# Altium schematic sheet ATMega328 Control Board.SchDoc
size 508 x 241 mm; SheetNumber: 1; SheetTotal: 1
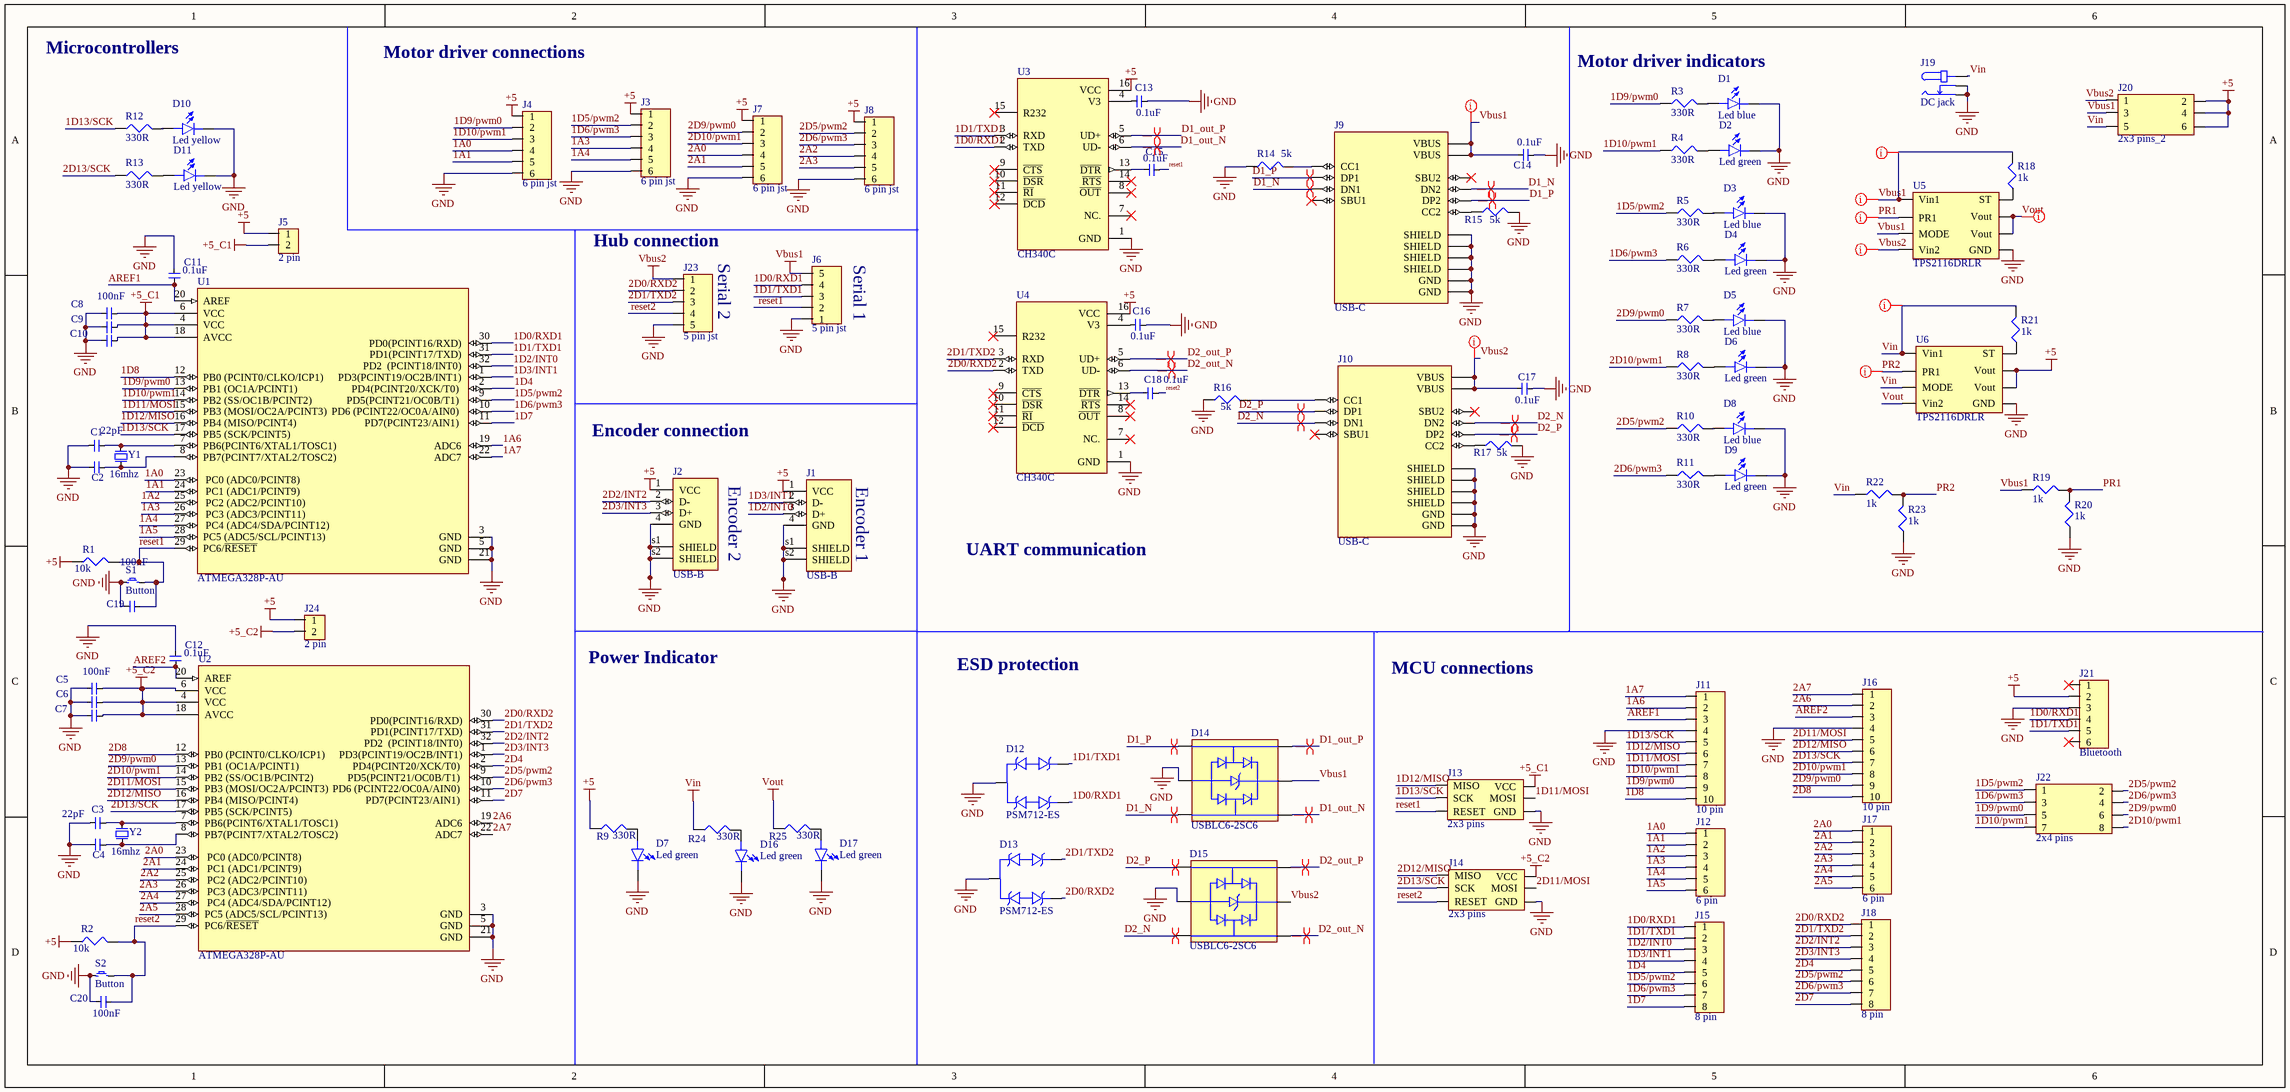
[diagram p0: ATMega328 Control Board.SchDoc]

## Parts
C1  22pF  [0603 cap]
C2  22pF  [0603 cap]  (value not drawn)
C3  22pF  [0603 cap]
C4  22pF  [0603 cap]  (value not drawn)
C5  100nF  [0603 cap]  (value not drawn)
C6  100nF  [0603 cap]  (value not drawn)
C7  100nF  [0603 cap]
C8  100nF  [0603 cap]  (value not drawn)
C9  100nF  [0603 cap]  (value not drawn)
C10  100nF  [0603 cap]
C11  0.1uF  [0603 cap]
C12  0.1uF  [0603 cap]
C13  0.1uF  [0603 cap]
C14  0.1uF  [0603 cap]
C15  0.1uF  [0603 cap]
C16  0.1uF  [0603 cap]
C17  0.1uF  [0603 cap]
C18  0.1uF  [0603 cap]
C19  100nF  [0603 cap]
C20  100nF  [0603 cap]
D1  Led blue  [0805led]
D2  Led green  [0805led]
D3  Led blue  [0805led]
D4  Led green  [0805led]
D5  Led blue  [0805led]
D6  Led green  [0805led]
D7  Led green  [0805led]
D8  Led blue  [0805led]
D9  Led green  [0805led]
D10  Led yellow  [0805led]
D11  Led yellow  [0805led]
D12  PSM712-ES  [sop23]
D13  PSM712-ES  [sop23]
D14  USBLC6-2SC6  [SOP23-6l]
D15  USBLC6-2SC6  [SOP23-6l]
D16  Led green  [0805led]
D17  Led green  [0805led]
J1  USB-B  [USB]
J2  USB-B  [USB]
J3  6 pin jst  [6 jst]
J4  6 pin jst  [6 jst]
J5  2 pin  [2 pin header]
J6  5 pin jst  [5 jst]
J7  6 pin jst  [6 jst]
J8  6 pin jst  [6 jst]
J9  USB-C  [USB-C]
J10  USB-C  [USB-C]
J11  10 pin  [10 pin header]
J12  6 pin  [6 pin header]
J13  2x3 pins  [2x3 pins]
J14  2x3 pins  [2x3 pins]
J15  8 pin  [8 pin heade]
J16  10 pin  [10 pin header]
J17  6 pin  [6 pin header]
J18  8 pin  [8 pin heade]
J19  DC jack  [DC jack]
J20  2x3 pins_2  [2x3 pins]
J21  Bluetooth  [6 pin header]
J22  2x4 pins  [2x4 pins]
J23  5 pin jst  [5 jst]
J24  2 pin  [2 pin header]
R1  10k  [0603 cap]
R2  10k  [0603 cap]
R3  330R  [0603 cap]
R4  330R  [0603 cap]
R5  330R  [0603 cap]
R6  330R  [0603 cap]
R7  330R  [0603 cap]
R8  330R  [0603 cap]
R9  330R  [0603 cap]
R10  330R  [0603 cap]
R11  330R  [0603 cap]
R12  330R  [0603 cap]
R13  330R  [0603 cap]
R14  5k  [0603 cap]
R15  5k  [0603 cap]
R16  5k  [0603 cap]
R17  5k  [0603 cap]
R18  1k  [0603 cap]
R19  1k  [0603 cap]
R20  1k  [0603 cap]
R21  1k  [0603 cap]
R22  1k  [0603 cap]
R23  1k  [0603 cap]
R24  330R  [0603 cap]
R25  330R  [0603 cap]
S1  Button  [button]
S2  Button  [button]
U1  ATMEGA328P-AU  [Quad32]
U2  ATMEGA328P-AU  [Quad32]
U3  CH340C  [sop 16]
U4  CH340C  [sop 16]
U5  TPS2116DRLR  [SOP8]
U6  TPS2116DRLR  [SOP8]
Y1  16mhz  [crystal]
Y2  16mhz  [crystal]

## Nets
+5: J1.1(VCC) J2.1(VCC) J3.1 J4.1 J5.1 J7.1 J8.1 J20.2 J20.4 J20.6 J21.2 J24.1 R1.1 R2.1 R9.1 U3.16(VCC) U4.16(VCC) U6.2(Vout) U6.7(Vout)
+5_C1: C8.2 C9.2 C10.2 J5.2 J13.2(VCC) U1.4(VCC) U1.6(VCC) U1.18(AVCC)
+5_C2: C5.2 C6.2 C7.2 J14.2(VCC) J24.2 U2.4(VCC) U2.6(VCC) U2.18(AVCC)
GND: C1.1 C2.1 C3.1 C4.1 C5.1 C6.1 C7.1 C8.1 C9.1 C10.1 C11.2 C12.2 C13.2 C14.2 C16.2 C17.2 C19.1 C20.1 D1.2 D2.2 D3.2 D4.2 D5.2 D6.2 D7.2 D8.2 D9.2 D10.2 D11.2 D12.3 D13.3 D14.2(GND) D15.2(GND) D16.2 D17.2 J1.4(GND) J1.s1(SHIELD) J1.s2(SHIELD) J2.4(GND) J2.s1(SHIELD) J2.s2(SHIELD) J3.6 J4.6 J6.1 J7.6 J8.6 J9.A1/B12(GND) J9.B1/A12(GND) J9.S1(SHIELD) J9.S2(SHIELD) J9.S3(SHIELD) J9.S4(SHIELD) J10.A1/B12(GND) J10.B1/A12(GND) J10.S1(SHIELD) J10.S2(SHIELD) J10.S3(SHIELD) J10.S4(SHIELD) J11.4 J13.6(GND) J14.6(GND) J16.4 J19.1 J19.3 J21.3 J23.5 R14.1 R15.2 R16.1 R17.2 R20.1 R23.1 S1.1 S2.1 U1.3(GND) U1.5(GND) U1.21(GND) U2.3(GND) U2.5(GND) U2.21(GND) U3.1(GND) U4.1(GND) U5.1(GND) U6.1(GND)
Vbus1: C14.1 D14.5(Vbus) J6.5 J9.A4/B9(VBUS) J9.B4/A9(VBUS) J20.3 R18.2 R19.1 U5.3(Vin1) U5.5(MODE)
Vbus2: C17.1 D15.5(Vbus) J10.A4/B9(VBUS) J10.B4/A9(VBUS) J20.1 J23.1 U5.6(Vin2)
Vin: J19.2 J20.5 R21.2 R22.1 R24.1 U6.3(Vin1) U6.5(MODE)
Vout: R25.1 U5.2(Vout) U5.7(Vout) U6.6(Vin2)
1A0: J4.4 J12.1 U1.23(PC0_(ADC0/PCINT8))
1A1: J4.5 J12.2 U1.24(PC1_(ADC1/PCINT9))
1A2: J12.3 U1.25(PC2_(ADC2/PCINT10))
1A3: J3.4 J12.4 U1.26(PC3_(ADC3/PCINT11))
1A4: J3.5 J12.5 U1.27(PC4_(ADC4/SDA/PCINT12))
1A5: J12.6 U1.28(PC5_(ADC5/SCL/PCINT13))
1A6: J11.2 U1.19(ADC6)
1A7: J11.1 U1.22(ADC7)
1D0/RXD1: D12.1 J6.4 J15.1 J21.4 U1.30(PD0(PCINT16/RXD)) U3.2(TXD)
1D1/TXD1: D12.2 J6.3 J15.2 J21.5 U1.31(PD1(PCINT17/TXD)) U3.3(RXD)
1D2/INT0: J1.3(D+) J15.3 U1.32(PD2__(PCINT18/INT0))
1D3/INT1: J1.2(D-) J15.4 U1.1(PD3(PCINT19/OC2B/INT1))
1D4: J15.5 U1.2(PD4(PCINT20/XCK/T0))
1D5/pwm2: J3.2 J15.6 J22.1 R5.1 U1.9(PD5(PCINT21/OC0B/T1))
1D6/pwm3: J3.3 J15.7 J22.3 R6.1 U1.10(PD6_(PCINT22/OC0A/AIN0))
1D7: J15.8 U1.11(PD7(PCINT23/AIN1))
1D8: J11.10 U1.12(PB0_(PCINT0/CLKO/ICP1))
1D9/pwm0: J4.2 J11.9 J22.5 R3.1 U1.13(PB1_(OC1A/PCINT1))
1D10/pwm1: J4.3 J11.8 J22.7 R4.1 U1.14(PB2_(SS/OC1B/PCINT2))
1D11/MOSI: J11.7 J13.4(MOSI) U1.15(PB3_(MOSI/OC2A/PCINT3))
1D12/MISO: J11.6 J13.1(MISO) U1.16(PB4_(MISO/PCINT4))
1D13/SCK: J11.5 J13.3(SCK) R12.1 U1.17(PB5_(SCK/PCINT5))
2A0: J7.4 J17.1 U2.23(PC0_(ADC0/PCINT8))
2A1: J7.5 J17.2 U2.24(PC1_(ADC1/PCINT9))
2A2: J8.4 J17.3 U2.25(PC2_(ADC2/PCINT10))
2A3: J8.5 J17.4 U2.26(PC3_(ADC3/PCINT11))
2A4: J17.5 U2.27(PC4_(ADC4/SDA/PCINT12))
2A5: J17.6 U2.28(PC5_(ADC5/SCL/PCINT13))
2A6: J16.2 U2.19(ADC6)
2A7: J16.1 U2.22(ADC7)
2D0/RXD2: D13.1 J18.1 J23.2 U2.30(PD0(PCINT16/RXD)) U4.2(TXD)
2D1/TXD2: D13.2 J18.2 J23.3 U2.31(PD1(PCINT17/TXD)) U4.3(RXD)
2D2/INT2: J2.2(D-) J18.3 U2.32(PD2__(PCINT18/INT0))
2D3/INT3: J2.3(D+) J18.4 U2.1(PD3(PCINT19/OC2B/INT1))
2D4: J18.5 U2.2(PD4(PCINT20/XCK/T0))
2D5/pwm2: J8.2 J18.6 J22.2 R10.1 U2.9(PD5(PCINT21/OC0B/T1))
2D6/pwm3: J8.3 J18.7 J22.4 R11.1 U2.10(PD6_(PCINT22/OC0A/AIN0))
2D7: J18.8 U2.11(PD7(PCINT23/AIN1))
2D8: J16.10 U2.12(PB0_(PCINT0/CLKO/ICP1))
2D9/pwm0: J7.2 J16.9 J22.6 R7.1 U2.13(PB1_(OC1A/PCINT1))
2D10/pwm1: J7.3 J16.8 J22.8 R8.1 U2.14(PB2_(SS/OC1B/PCINT2))
2D11/MOSI: J14.4(MOSI) J16.5 U2.15(PB3_(MOSI/OC2A/PCINT3))
2D12/MISO: J14.1(MISO) J16.6 U2.16(PB4_(MISO/PCINT4))
2D13/SCK: J14.3(SCK) J16.7 R13.1 U2.17(PB5_(SCK/PCINT5))
AREF1: C11.1 J11.3 U1.20(AREF)
AREF2: C12.1 J16.3 U2.20(AREF)
D1_N: D14.3(I/O_2) J9.A7(DN1) J9.B7(DN2)
D1_out_N: D14.4(I/O_2) U3.6(UD-)
D1_out_P: D14.6(I/O_1) U3.5(UD+)
D1_P: D14.1(I/O_1) J9.A6(DP1) J9.B6(DP2)
D2_N: D15.3(I/O_2) J10.A7(DN1) J10.B7(DN2)
D2_out_N: D15.4(I/O_2) U4.6(UD-)
D2_out_P: D15.6(I/O_1) U4.5(UD+)
D2_P: D15.1(I/O_1) J10.A6(DP1) J10.B6(DP2)
PR1: R19.2 R20.2 U5.4(PR1)
PR2: R22.2 R23.2 U6.4(PR1)
reset1: C15.2 C19.2 J6.2 J13.5(RESET) R1.2 S1.2 U1.29(PC6/~{RESET})
reset2: C18.2 C20.2 J14.5(RESET) J23.4 R2.2 S2.2 U2.29(PC6/~{RESET})
NetC1_2: C1.2 U1.7(PB6(PCINT6/XTAL1/TOSC1)) Y1.2
NetC2_2: C2.2 U1.8(PB7(PCINT7/XTAL2/TOSC2)) Y1.1
NetC3_2: C3.2 U2.7(PB6(PCINT6/XTAL1/TOSC1)) Y2.2
NetC4_2: C4.2 U2.8(PB7(PCINT7/XTAL2/TOSC2)) Y2.1
NetC13_1: C13.1 U3.4(V3)
NetC15_1: C15.1 U3.13(~{DTR})
NetC16_1: C16.1 U4.4(V3)
NetC18_1: C18.1 U4.13(~{DTR})
NetD1_1: D1.1 R3.2
NetD2_1: D2.1 R4.2
NetD3_1: D3.1 R5.2
NetD4_1: D4.1 R6.2
NetD5_1: D5.1 R7.2
NetD6_1: D6.1 R8.2
NetD7_1: D7.1 R9.2
NetD8_1: D8.1 R10.2
NetD9_1: D9.1 R11.2
NetD10_1: D10.1 R12.2
NetD11_1: D11.1 R13.2
NetD16_1: D16.1 R24.2
NetD17_1: D17.1 R25.2
NetJ9_A5: J9.A5(CC1) R14.2
NetJ9_B5: J9.B5(CC2) R15.1
NetJ10_A5: J10.A5(CC1) R16.2
NetJ10_B5: J10.B5(CC2) R17.1
NetR18_1: R18.1 U5.8(ST)
NetR21_1: R21.1 U6.8(ST)

Not connected (* = marked no-connect by the designer): J9 A8(SBU1)* B8(SBU2)*; J10 A8(SBU1)* B8(SBU2)*; J21 1* 6*; U3 7(NC.)* 8(~{OUT})* 9(~{CTS})* 10(~{DSR})* 11(~{RI})* 12(~{DCD})* 14(~{RTS})* 15(R232)*; U4 7(NC.)* 8(~{OUT})* 9(~{CTS})* 10(~{DSR})* 11(~{RI})* 12(~{DCD})* 14(~{RTS})* 15(R232)*

## Layout directives
differential pair; net class diff_signals: D1_N, D1_out_N, D1_out_P, D1_P, D2_N, D2_out_N, D2_out_P, D2_P
net class V_BUS: Vbus1, Vbus2
net class power: PR1, PR2, Vbus1, Vbus2, Vin, Vout

## Notes on the sheet
- Microcontrollers
- Motor driver connections
- Motor driver indicators
- (near J23) Hub connection
- (near J23) Serial 2
- (near J6) Serial 1
- Encoder connection
- Encoder 2
- (near J1) Encoder 1
- UART communication
- Power Indicator
- ESD protection
- MCU connections

## Library data of the parts
C1-C4 = 22pF capacitor: 50V 22pF C0G ±5% 0603 Multilayer Ceramic Capacitors MLCC - SMD/SMT ROHS; Manufacturer: PSA(Prosperity Dielectrics); Mfr. Part #: FN18N220J500PSG; supplier: LCSC; LCSC Part #: C525244
C5-C20 = 100nF capacitor: 50V 100nF X7R ±10% 0603 Multilayer Ceramic Capacitors MLCC - SMD/SMT ROHS; Manufacturer: PSA(Prosperity Dielectrics); Mfr. Part #: FN18X104K500PBG; supplier: LCSC; LCSC Part #: C235731
D1 D3 D5 D8 = Led blue: Blue 0603 Light Emitting Diodes (LED) ROHS; Manufacturer: Yongyu Photoelectric; Mfr. Part #: SZYY0805B; supplier: LCSC; LCSC Part #: C434433
D2 D4 D6 D7 D9 D16 D17 = Led green: Emerald 0805 Light Emitting Diodes (LED) ROHS; Manufacturer: Yongyu Photoelectric; Mfr. Part #: SZYY0805G; supplier: LCSC; LCSC Part #: C434432
D10 D11 = Led yellow: 10mA 无色透明透镜 -40℃~+85℃ 584nm~594nm Yellow 120° 40mW 0805 Light Emitting Diodes (LED) ROHS; Manufacturer: Yongyu Photoelectric; Mfr. Part #: SZYY0805Y; supplier: LCSC; LCSC Part #: C434436
D12 D13 = PSM712-ES: 17A 350W Bi-Directional SOT-23 Electrostatic and Surge Protection (TVS/ESD) ROHS; Manufacturer: ElecSuper; Mfr. Part #: PSM712-ES; Supplier: LCSC; LCSC Part #: C5180294
D14 D15 = USBLC6-2SC6: 5A 17V 6V Unidirectional 5.25V SOT-23-6 Electrostatic and Surge Protection (TVS/ESD) ROHS; Manufacturer: STMicroelectronics; Mfr. Part #: USBLC6-2SC6; supplier: LCSC; LCSC Part #: C7519
J1 J2 = USB-B: USB 2.0 1 4P Female Type-B Plugin USB Connectors ROHS / ROHS; Manufacturer: Jing Extension of the Electronic Co.; Mfr. Part #: 921-111A1010D10200; supplier: LCSC; LCSC Part #: C46392
J3 J4 J7 J8 = 6 pin jst: 1x6P 6P XH 1 2.5mm 6 Plugin,P=2.5mm Wire To Board Connector ROHS; Manufacturer: BOOMELE; Mfr. Part #: XH-6A; supplier: LCSC; LCSC Part #: C5663
J5 J24 = 2 pin: Straight Square Pins 2.5mm 6mm 2P -40℃~+105℃ 3mm 2.54mm Black Brass Plugin 1x2P Plugin,P=2.54mm Pin Headers ROHS; Manufacturer: XUNPU; Mfr. Part #: PH2.54-01-02PZD; supplier: LCSC; LCSC Part #: C7501580
J6 J23 = 5 pin jst: 1x5P 5P XH 1 2.5mm 6 Plugin,P=2.5mm Wire To Board Connector ROHS; Manufacturer: BOOMELE; Mfr. Part #: XH-6A; supplier: LCSC; LCSC Part #: C5663
J9 J10 = USB-C: 5A 1 16P Female Type-C SMD USB Connectors ROHS; Manufacturer: Korean Hroparts Elec; Mfr. Part #: TYPE-C-31-M-12; supplier: LCSC; LCSC Part #: C165948
J11 J16 = 10 pin: 2.54mm Plugin 3A 10P -40℃~+105℃ Straight 1x10P 8.5mm Top Square Holes Plugin,P=2.54mm Female Headers ROHS; Manufacturer: Shenzhen Kinghelm Elec; Mfr. Part #: KH-2.54FH-1X10P-H8.5; supplier: LCSC; LCSC Part #: C2905418
J12 J17 J21 = 6 pin: 2.54mm Plugin 6P Straight 1x6P Plugin,P=2.54mm Female Headers ROHS; Manufacturer: BOOMELE; Mfr. Part #: 2.54-1*6P; supplier: LCSC; LCSC Part #: C40877
J13 J14 = 2x3 pins: Straight 2.54mm 6mm 6P 3mm 2.54mm 双排 2x3P Plugin,P=2.54mm Pin Headers ROHS; Manufacturer: HanElectricity; Mfr. Part #: 2541WV-2x03P; supplier: LCSC; LCSC Part #: C5383104
J15 J18 = 8 pin: 2.54mm Plugin 8P Straight 1x8P Plugin,P=2.54mm Female Headers ROHS; Manufacturer: BOOMELE; Mfr. Part #: 2.54-1*8P; supplier: LCSC; LCSC Part #: C27438
J19 = DC jack: Panel Mounting DC Power Receptacle 260℃ Brass -20℃~+70℃ 2mm 6.2mm 2.5A 24V Plugin DC Power Connector ROHS; Manufacturer: XKB Connection; Mfr. Part #: DC-005-2.5A-2.0; Supplier: LCSC; LCSC Part #: C319099
J20 = 2x3 pins_2: Straight 2.54mm 6mm 6P 3mm 2.54mm 双排 2x3P Plugin,P=2.54mm Pin Headers ROHS; Manufacturer: HanElectricity; Mfr. Part #: 2541WV-2x03P; supplier: LCSC; LCSC Part #: C5383104
J22 = 2x4 pins: 3A Straight Square Pins 2.5mm 8P 6mm -40℃~+105℃ 3mm 2.54mm 双排 Black 2.54mm 2x4P Plugin,P=2.54mm Pin Headers ROHS; Manufacturer: Liansheng; Mfr. Part #: PH-00179; supplier: LCSC; LCSC Part #: C2829882
R1 R2 = 10k resistor: 100mW Thick Film Resistors 75V ±100ppm/℃ ±1% 10kΩ 0603 Chip Resistor - Surface Mount ROHS; Manufacturer: UNI-ROYAL(Uniroyal Elec); Mfr. Part #: 0603WAF1002T5E; supplier: LCSC; LCSC Part #: C25804
R3-R13 R24 R25 = 330R: 100mW Thick Film Resistors 75V ±100ppm/℃ ±1% 330Ω 0603 Chip Resistor - Surface Mount ROHS; Manufacturer: UNI-ROYAL(Uniroyal Elec); Mfr. Part #: 0603WAF3300T5E; supplier: LCSC; LCSC Part #: C23138
R14-R17 = 5k: 100mW Thick Film Resistors 75V ±100ppm/℃ ±1% 330Ω 0603 Chip Resistor - Surface Mount ROHS; Manufacturer: UNI-ROYAL(Uniroyal Elec); Mfr. Part #: 0603WAF5101T5E; supplier: LCSC; LCSC Part #: C23186
R18-R23 = 1k resistor: 100mW Thick Film Resistors 75V ±100ppm/℃ ±1% 1kΩ 0603 Chip Resistor - Surface Mount ROHS; Manufacturer: UNI-ROYAL(Uniroyal Elec); Mfr. Part #: 0603WAF1001T5E; supplier: LCSC; LCSC Part #: C21190
S1 S2 = tactile button: No 不带 50mA 6mm 100MΩ 100,000 Times 12V 250gf 3.6mm 2.5mm Rectangle button Brick nogging SPST SMD Tactile Switches ROHS; Manufacturer: USAKRO; Mfr. Part #: UK-B0240-R-250; supplier: LCSC; LCSC Part #: C556660
U1 U2 = ATMEGA328P-AU: 32KB 2KB FLASH 23 1.8V~5.5V AVR 20MHz TQFP-32(7x7) Microcontroller Units (MCUs/MPUs/SOCs) ROHS; Manufacturer: Microchip Tech; Mfr. Part #: ATMEGA328P-AU; supplier: LCSC; LCSC Part #: C14877
U3 U4 = CH340C: 2Mbps Transceiver USB 2.0 SOP-16 USB ICs ROHS; Manufacturer: WCH; Mfr. Part #: CH340C; supplier: LCSC; LCSC Part #: C84681
U5 U6 = TPS2116DRLR: 1.6V~5.5V 42mΩ 2.5A 1 SOT-583 Power Distribution Switches ROHS; Manufacturer: Texas Instruments; Mfr. Part #: TPS2116DRLR; supplier: LCSC; LCSC Part #: C3235557
Y1 Y2 = Crystal 16mhz: 16MHz 16pF ±20ppm ±20ppm HC-49S-SMD Crystals ROHS; Manufacturer: KYX; Mfr. Part #: KBD160001620; supplier: LCSC; LCSC Part #: C18209148